# Altium schematic sheet analog_part.SchDoc
size A4
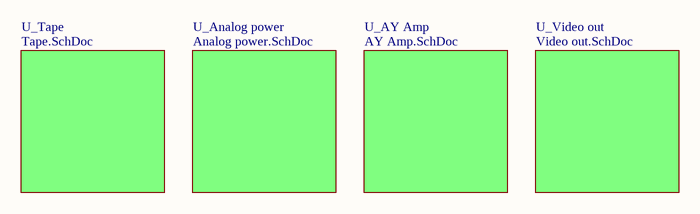
[diagram p0: analog_part.SchDoc]

## Sub-sheets
U_Analog power = Analog power.SchDoc: no entries
U_AY Amp = AY Amp.SchDoc: no entries
U_Tape = Tape.SchDoc: no entries
U_Video out = Video out.SchDoc: no entries